# Altium project FMC_AWG_Common.PrjPCB (part 5 of 5)

## Sheet Translators_AWG.SchDoc: FMC DAC 1.5GS 4CH
size 420 x 297 mm; Author: G.Kasprowicz; CompanyName: WUT ISE; DrawnBy: G.Kasprowicz; Organization: WUT ISE; Address1: PW ISE; Address2: Nowowiejska 15/19 00-665 Warsaw; Address3: gkasprow@gmail.com; DocumentNumber: 12; Revision: 1; SheetNumber: 12; SheetTotal: 12; ModifiedBy: -; CheckedDate: -; Title2: Translators; DivGrp: WUT ISE; Designer: G.Kasprowicz; ModifiedDate: -; ProjectName: Sensor Box
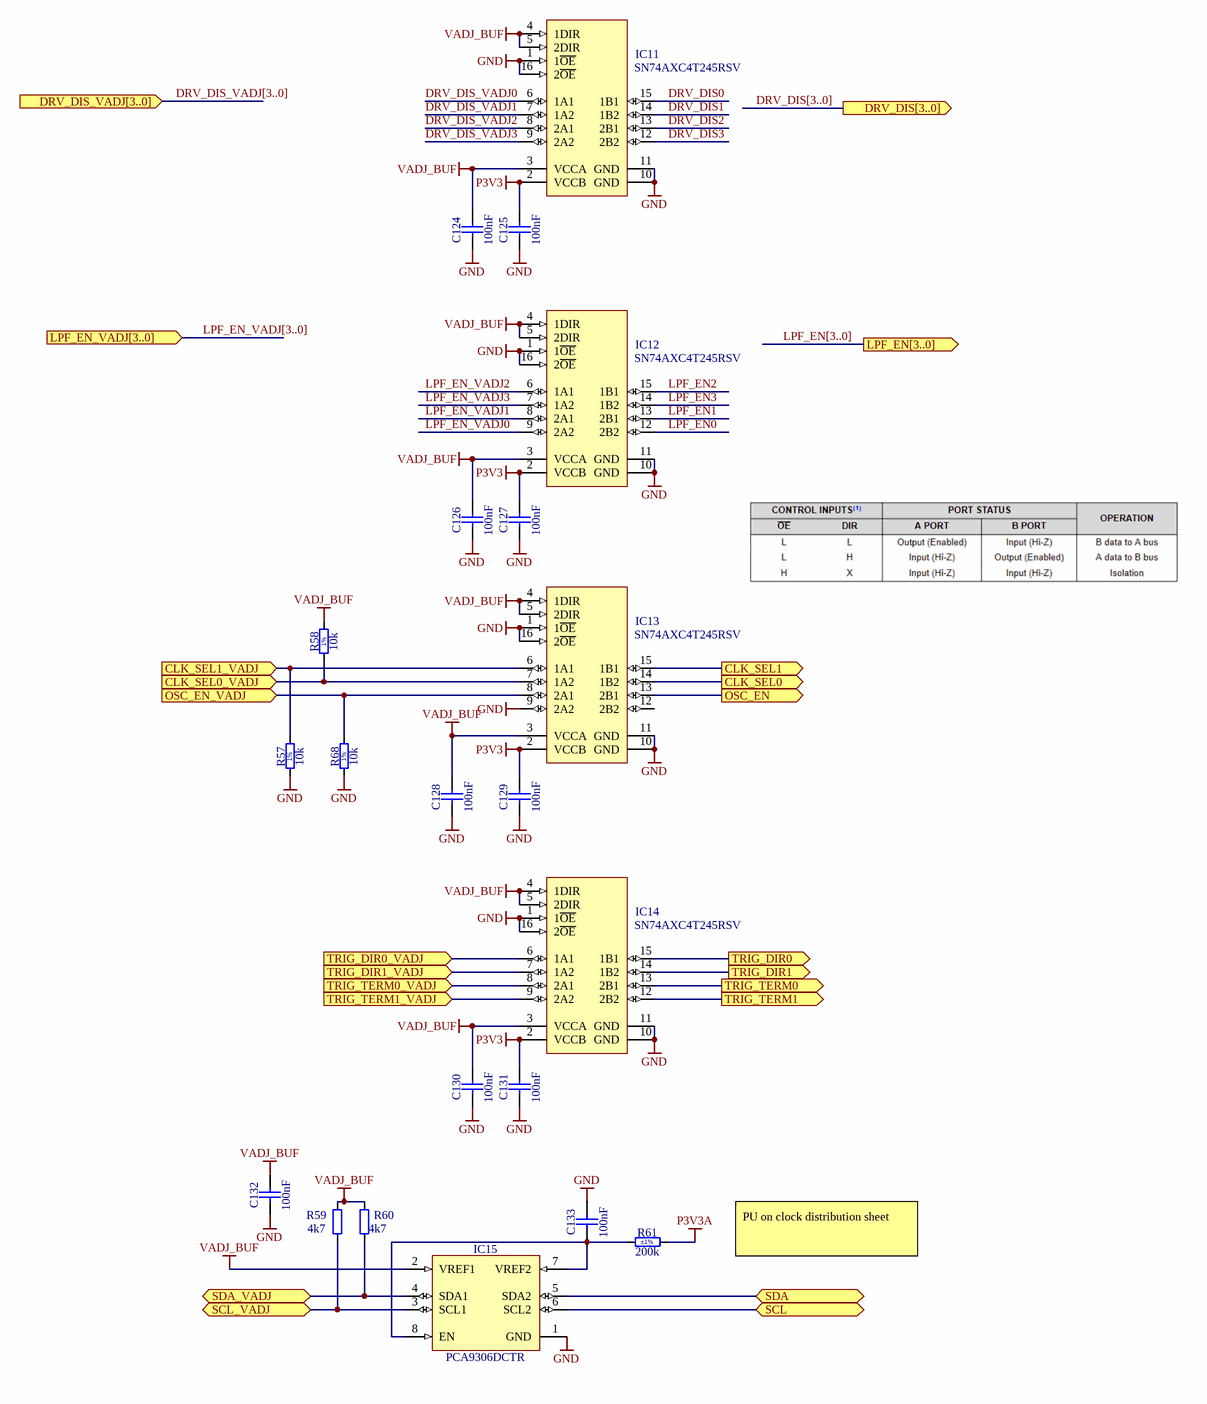
[diagram p11: Translators_AWG.SchDoc]

### Parts
C124  100nF  [CAPC1005X55N]
C125  100nF  [CAPC1005X55N]
C126  100nF  [CAPC1005X55N]
C127  100nF  [CAPC1005X55N]
C128  100nF  [CAPC1005X55N]
C129  100nF  [CAPC1005X55N]
C130  100nF  [CAPC1005X55N]
C131  100nF  [CAPC1005X55N]
C132  100nF  [CAPC1005X55N]
C133  100nF  [CAPC1005X55N]
IC11  SN74AXC4T245RSV  [QFN40P180X260X55-16N]
IC12  SN74AXC4T245RSV  [QFN40P180X260X55-16N]
IC13  SN74AXC4T245RSV  [QFN40P180X260X55-16N]
IC14  SN74AXC4T245RSV  [QFN40P180X260X55-16N]
IC15  PCA9306DCTR  [SOP65P400X130-8N]
R57  10k  [RESC1005X40N]
R58  10k  [RESC1005X40N]
R59  4k7  [RESC1005X40N]
R60  4k7  [RESC1005X40N]
R61  200k  Tolerance: ±1%  [RESC1005X40N]
R68  10k  [RESC1005X40N]

### Ports
CLK_SEL0 (out), CLK_SEL0_VADJ (in), CLK_SEL1 (out), CLK_SEL1_VADJ (in), DRV_DIS[3..0] (out), DRV_DIS_VADJ[3..0] (in), LPF_EN[3..0] (out), LPF_EN_VADJ[3..0] (in), OSC_EN (out), OSC_EN_VADJ (in), SCL (bidir), SCL_VADJ (bidir), SDA (bidir), SDA_VADJ (bidir), TRIG_DIR0 (out), TRIG_DIR0_VADJ (in), TRIG_DIR1 (out), TRIG_DIR1_VADJ (in), TRIG_TERM0 (out), TRIG_TERM0_VADJ (in), TRIG_TERM1 (out), TRIG_TERM1_VADJ (in)

### Nets
GND: C124.1 C125.1 C126.1 C127.1 C128.1 C129.1 C130.1 C131.1 C132.1 C133.2 IC11.1(1~{OE}) IC11.10(GND) IC11.11(GND) IC11.16(2~{OE}) IC12.1(1~{OE}) IC12.10(GND) IC12.11(GND) IC12.16(2~{OE}) IC13.1(1~{OE}) IC13.9(2A2) IC13.10(GND) IC13.11(GND) IC13.16(2~{OE}) IC14.1(1~{OE}) IC14.10(GND) IC14.11(GND) IC14.16(2~{OE}) IC15.1(GND) R57.1 R68.1
P3V3: C125.2 C127.2 C129.2 C131.2 IC11.2(VCCB) IC12.2(VCCB) IC13.2(VCCB) IC14.2(VCCB)
P3V3A: R61.2
VADJ_BUF: C124.2 C126.2 C128.2 C130.2 C132.2 IC11.3(VCCA) IC11.4(1DIR) IC11.5(2DIR) IC12.3(VCCA) IC12.4(1DIR) IC12.5(2DIR) IC13.3(VCCA) IC13.4(1DIR) IC13.5(2DIR) IC14.3(VCCA) IC14.4(1DIR) IC14.5(2DIR) IC15.2(VREF1) R58.2 R59.2 R60.2
CLK_SEL0: IC13.14(1B2) ; port CLK_SEL0
CLK_SEL1: IC13.15(1B1) ; port CLK_SEL1
DRV_DIS0: IC11.15(1B1)
DRV_DIS1: IC11.14(1B2)
DRV_DIS2: IC11.13(2B1)
DRV_DIS3: IC11.12(2B2)
DRV_DIS_VADJ0: IC11.6(1A1)
DRV_DIS_VADJ1: IC11.7(1A2)
DRV_DIS_VADJ2: IC11.8(2A1)
DRV_DIS_VADJ3: IC11.9(2A2)
HA01_CC_N: IC15.4(SDA1) R60.1 ; port SDA_VADJ
HA01_CC_P: IC15.3(SCL1) R59.1 ; port SCL_VADJ
HA02_N: IC14.8(2A1) ; port TRIG_TERM0_VADJ
HA02_P: IC14.9(2A2) ; port TRIG_TERM1_VADJ
HA06_P: IC14.6(1A1) ; port TRIG_DIR0_VADJ
HA07_P: IC14.7(1A2) ; port TRIG_DIR1_VADJ
HA13_N: IC13.8(2A1) R68.2 ; port OSC_EN_VADJ
HA16_N: IC13.6(1A1) R57.2 ; port CLK_SEL1_VADJ
HA16_P: IC13.7(1A2) R58.1 ; port CLK_SEL0_VADJ
LPF_EN0: IC12.12(2B2)
LPF_EN1: IC12.13(2B1)
LPF_EN2: IC12.15(1B1)
LPF_EN3: IC12.14(1B2)
LPF_EN_VADJ0: IC12.9(2A2)  [project net HA11_P]
LPF_EN_VADJ1: IC12.8(2A1)  [project net HA12_P]
LPF_EN_VADJ2: IC12.6(1A1)  [project net HA06_N]
LPF_EN_VADJ3: IC12.7(1A2)  [project net HA12_N]
NetC133_1: C133.1 IC15.7(VREF2) IC15.8(EN) R61.1
NetIC13_13: IC13.13(2B1) ; port OSC_EN
NetIC14_12: IC14.12(2B2) ; port TRIG_TERM1
NetIC14_13: IC14.13(2B1) ; port TRIG_TERM0
NetIC14_14: IC14.14(1B2) ; port TRIG_DIR1
NetIC14_15: IC14.15(1B1) ; port TRIG_DIR0
NetIC15_5: IC15.5(SDA2) ; port SDA
NetIC15_6: IC15.6(SCL2) ; port SCL

Not connected (* = marked no-connect by the designer): IC13 12(2B2)

### Buses and harness runs
bus DRV_DIS[3..0] = port DRV_DIS[3..0]
bus DRV_DIS_VADJ[3..0] = port DRV_DIS_VADJ[3..0]
bus LPF_EN[3..0] = port LPF_EN[3..0]
bus LPF_EN_VADJ[3..0] = port LPF_EN_VADJ[3..0]

### Notes on the sheet
- PU on clock distribution sheet
- Project/Equipment
- Document
- Designer
- Drawn by
- Check.by
- Copyright WUT ISE 2018.
  This documentation describes Open Hardware and is licensed under the CERN OHL v.1.1. You may redistribute and modify this documentation under the terms of the CERN OHL v.1.1. (http://ohwr.org/CERNOHL). This documentation is distributed WITHOUT ANY EXPRESS OR IMPLIED WARRANTY, INCLUDING OF MERCHANTABILITY, SATISFACTORY QUALITY AND FITNESS FOR A PARTICULAR PURPOSE. Please see the CERN OHL v.1.1 for applicable conditions.
- Contact
- File
- Last Mod.
- Print Date
- Sheet
- Size
- A3
- of
- Rev
- (in symbol R0402_10K_1%_0.0625W_100PPM) 1%

### Library data of the parts
C124-C133 = CC0402_100NF_16V_10%_X7R: Non-polarised capacitor; Part Description: SMD Multilayer Chip Ceramic Capacitor; Manufacturer: GENERIC; Manufacturer1 Part Number: GRM155R71C104KA88D; Voltage: 16V; TC: X7R; Tolerance: ±10%; Part Number: CC0402_100NF_16V_10%_X7R; Component Kind: Standard; Component Type: Standard; Pin Count: 2; Value: 100nF; Status: Not Recommended; Manufacturer Part Number: CC0402_100NF_16V_10%_X7R; Case: 0402; Mounted: Yes; Socket: No; SMD: Yes; Sense: No; Manufacturer1 Example: MURATA; Manufacturer1 ComponentHeight: 0.55mm; HelpURL: \\cern.ch\dfs\Applications\Altium\Datasheets\CC0402_X7R_MURATA_GRM.pdf; Author: CERN DEM JLC; CreateDate: 05.12.2013; LatestRevisionDate: 03.12.2007
IC11-IC14 = SN74AXC4T245: 4-Bit Dual-Supply Bus Transceiver with Configurable Voltage Translation and 3-State Output; Part Description: 4-Bit Dual-Supply Bus Transceiver With Configurable Voltage Translation and 3-State Outputs; Manufacturer: TEXAS INSTRUMENTS; PressFit: No; Bonding: No; Part Number: SN74AXC4T245RSV; Component Kind: Standard; Component Type: Standard; Device: SN74AXC4T245RSV; PackageDescription: QFN, 0.40mm Pitch, Rect.; 16 Pin, 2.60mm L X 1.80mm W X 0.55mm H Body, IPC Medium Density; Status: Recommended; Manufacturer Part Number: SN74AXC4T245RSV; Pin Count: 16; Case: QFN16; Mounted: Yes; Socket: No; SMD: Yes; Sense: No; ComponentHeight: 0.55mm; Author: GK; HelpURL: \\cern.ch\dfs\Applications\Altium\Datasheets\SN74AVC4T245RSVR.pdf; CreateDate: 08.07.2014; LatestRevisionDate: 30.03.2017
IC15 = PCA9306DCTR: Dual Bidirectional I2C Bus And SMBus Voltage-Level Translator; Manufacturer: TEXAS INSTRUMENTS; Table: Analog & Interface; Part Number: PCA9306DCTR; Component Kind: Standard; Component Type: Standard; Device: PCA9306DCTR; PackageDescription: SOP, 0.65mm, Pitch; 8 Pin, 2.80mm W X 2.95mm L X 1.30mm H Body, PC Medium Density; Part Description: Dual Bidirectional I2C Bus And SMBus Voltage-Level Translator; Manufacturer Part Number: PCA9306DCTR; Pin Count: 8; Case: SSOP8; Mounted: Yes; Socket: No; SMD: Yes; ComponentHeight: 1.3mm; Author: CERN DEM JLC; HelpURL: \\cern.ch\dfs\Applications\Altium\Datasheets\PCA9306DCTR.pdf; CreateDate: 2013-02-25; LatestRevisionDate: 2013-02-25
R57 R58 R68 = R0402_10K_1%_0.0625W_100PPM: as R51 on sheet EEPROM_Temp; Part Number: R0402_10K_1%_0.0625W_100PPM; Component Kind: Standard; Component Type: Standard; Pin Count: 2; Value: 10k; Status: Not recommended; Power: 0.0625W; Tolerance: ±1%; Manufacturer Part Number: R0402_10K_1%_0.0625W_100PPM; Case: 0402; Mounted: Yes; Socket: No; SMD: Yes; Manufacturer1 Example: YAGEO PHYCOMP; Manufacturer1 ComponentHeight: 0.4mm; HelpURL: \\cern.ch\dfs\Applications\Altium\Datasheets\R0402_Phycomp_RC0402.pdf; Author: CERN DEM JLC; CreateDate: 3/12/2007; LatestRevisionDate: 17/10/2012
R59 R60 = R0402_4k7_1%_0.0625W_100PPM: Resistor - 1%; Part Description: General Purpose Thick Film Chip Resistor; Manufacturer: GENERIC; Manufacturer1 Part Number: 232270674702L; TC: ±100ppm/°C; PressFit: No; Part Number: R0402_4K7_1%_0.0625W_100PPM; Component Kind: Standard; Component Type: Standard; Pin Count: 2; Value: 4k7; Status: Not Recommended; Power: 0.0625W; Tolerance: ±1%; Manufacturer Part Number: R0402_4K7_1%_0.0625W_100PPM; Case: 0402; Mounted: Yes; Socket: No; SMD: Yes; Manufacturer1 Example: YAGEO PHYCOMP; Manufacturer1 ComponentHeight: 0.4mm; HelpURL: \\cern.ch\dfs\Applications\Altium\Datasheets\R0402_Phycomp_RC0402.pdf; Author: CERN DEM JLC; CreateDate: 03.12.2007; LatestRevisionDate: 17.10.2012; Sense: No
R61 = R0402_200K_1%_0.0625W_100PPM: Resistor - 1%; Part Description: General Purpose Thick Film Chip Resistor; Manufacturer: GENERIC; Manufacturer1 Part Number: 232270672004L; TC: ±100ppm/°C; PressFit: No; Part Number: R0402_200K_1%_0.0625W_100PPM; Component Kind: Standard; Component Type: Standard; Pin Count: 2; Value: 200k; Status: Not Recommended; Power: 0.0625W; Manufacturer Part Number: R0402_200K_1%_0.0625W_100PPM; Case: 0402; Mounted: Yes; Sense: No; Socket: No; SMD: Yes; Manufacturer1 Example: YAGEO PHYCOMP; Manufacturer1 ComponentHeight: 0.4mm; HelpURL: \\cern.ch\dfs\Applications\Altium\Datasheets\R0402_Phycomp_RC0402.pdf; Author: CERN DEM JLC; CreateDate: 03.12.2007; LatestRevisionDate: 17.10.2012

## Sheet IO_CTRL.SchDoc: FMC DAC 1.5GS 4CH
size 420 x 297 mm; Author: G.Kasprowicz; CompanyName: WUT ISE; DrawnBy: G.Kasprowicz; Organization: WUT ISE; Address1: PW ISE; Address2: Nowowiejska 15/19 00-665 Warsaw; Address3: gkasprow@gmail.com; DocumentNumber: 8; Revision: 1; SheetNumber: 8; SheetTotal: 12; ModifiedBy: -; CheckedDate: -; Title2: IO CTRL; DivGrp: WUT ISE; Designer: G.Kasprowicz; ModifiedDate: -; ProjectName: Sensor Box
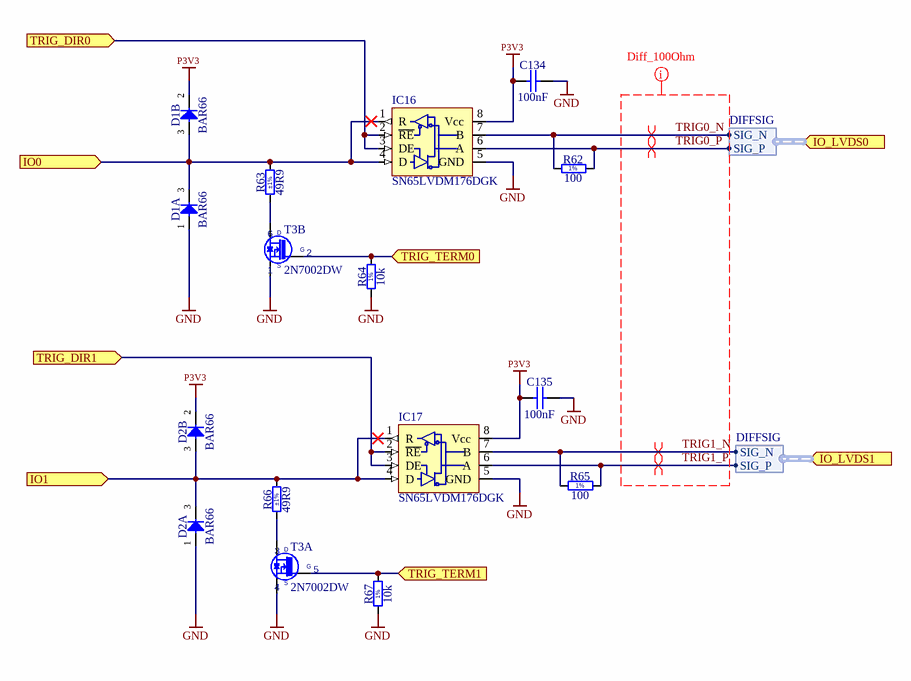
[diagram p12: IO_CTRL.SchDoc]

### Parts
C134  100nF  [CAPC1005X55N]
C135  100nF  [CAPC1005X55N]
D1  BAR66  [SOT95P240X110-3N]  (parts A,B of 2)
D2  BAR66  [SOT95P240X110-3N]  (parts A,B of 2)
IC16  SN65LVDM176DGK  [MSOP8 TI/AD]
IC17  SN65LVDM176DGK  [MSOP8 TI/AD]
R62  100  [RESC0603X28N]
R63  49R9  Tolerance: ±1%  [RESC3225X70N]
R64  10k  [RESC1005X40N]
R65  100  [RESC0603X28N]
R66  49R9  Tolerance: ±1%  [RESC3225X70N]
R67  10k  [RESC1005X40N]
T3  2N7002DW  [SOT65P210X110-6N]  (parts A,B of 2)

### Ports
IO0 (in), IO1 (in), IO_LVDS0 (in, harness DIFFSIG), IO_LVDS1 (in, harness DIFFSIG), TRIG_DIR0 (in), TRIG_DIR1 (in), TRIG_TERM0 (in), TRIG_TERM1 (in)

### Harnesses
DIFFSIG: SIG_N, SIG_P

### Nets
GND: C134.2 C135.2 D1.1(A) D2.1(A) IC16.5(GND) IC17.5(GND) R64.1 R67.1 T3.1(S2) T3.4(S1)
P3V3: C134.1 C135.1 D1.2(C) D2.2(C) IC16.8(Vcc) IC17.8(Vcc)
TRIG0_N: IC16.7(B) R62.1 ; port IO_LVDS0.SIG_N  [project net HB20_N]
TRIG0_P: IC16.6(A) R62.2 ; port IO_LVDS0.SIG_P  [project net HB20_P]
TRIG1_N: IC17.7(B) R65.1 ; port IO_LVDS1.SIG_N  [project net HB17_CC_N]
TRIG1_P: IC17.6(A) R65.2 ; port IO_LVDS1.SIG_P  [project net HB17_CC_P]
NetD1_3: D1.3(COMAC) IC16.1(R) IC16.4(D) R63.2 ; port IO0
NetD2_3: D2.3(COMAC) IC17.1(R) IC17.4(D) R66.2 ; port IO1
NetIC14_12: R67.2 T3.5(G1) ; port TRIG_TERM1
NetIC14_13: R64.2 T3.2(G2) ; port TRIG_TERM0
NetIC14_14: IC17.2(~{RE}) IC17.3(DE) ; port TRIG_DIR1
NetIC14_15: IC16.2(~{RE}) IC16.3(DE) ; port TRIG_DIR0
NetR63_1: R63.1 T3.6(D2)
NetR66_1: R66.1 T3.3(D1)

### Layout directives
differential pair: HB17_CC_N, HB17_CC_P, HB20_N, HB20_P
net class Diff_100Ohm: TRIG0_N, TRIG0_P, TRIG1_N, TRIG1_P

### Notes on the sheet
- Project/Equipment
- Document
- Designer
- Drawn by
- Check.by
- Copyright WUT ISE 2018.
  This documentation describes Open Hardware and is licensed under the CERN OHL v.1.1. You may redistribute and modify this documentation under the terms of the CERN OHL v.1.1. (http://ohwr.org/CERNOHL). This documentation is distributed WITHOUT ANY EXPRESS OR IMPLIED WARRANTY, INCLUDING OF MERCHANTABILITY, SATISFACTORY QUALITY AND FITNESS FOR A PARTICULAR PURPOSE. Please see the CERN OHL v.1.1 for applicable conditions.
- Contact
- File
- Last Mod.
- Print Date
- Sheet
- Size
- A3
- of
- Rev
- (in symbol 2N7002DW, part A) D; G; S
- (in symbol 2N7002DW, part B) D; G; S
- (in symbol R0201_100R_1%_0.05W_200PPM) 1%
- (in symbol R0402_10K_1%_0.0625W_100PPM) 1%

### Library data of the parts
C134 C135 = CC0402_100NF_16V_10%_X5R: Non-polarised capacitor; Part Description: SMD Multilayer Chip Ceramic Capacitor; Manufacturer: GENERIC; Manufacturer1 Part Number: GRM155R61C104KA88D; Voltage: 16V; TC: X5R; Tolerance: ±10%; Part Number: CC0402_100NF_16V_10%_X5R; Component Kind: Standard; Component Type: Standard; Pin Count: 2; Value: 100nF; Status: None; Manufacturer Part Number: CC0402_100NF_16V_10%_X5R; Case: 0402; Mounted: Yes; Socket: No; SMD: Yes; Sense: No; Manufacturer1 Example: MURATA; Manufacturer1 ComponentHeight: 0.55mm; HelpURL: \\cern.ch\dfs\Applications\Altium\Datasheets\CC0402_X5R_MURATA_GRM.pdf; Author: CERN DEM JLC; CreateDate: 10.12.2013; LatestRevisionDate: 10.12.2013
D1 D2 = BAR66: Serial Diode; Part Description: Silicon PIN Diode Array (Series Connected); Manufacturer: INFINEON; Voltage: 150V; Power: 250mA; Table: Diodes; Part Number: BAR66; Component Kind: Standard; Component Type: Standard; Device: BAR66; PackageDescription: SOT23 3-Leads, Pitch 0.95mm - Body 1.3x2.9mm, IPC Medium Density; Manufacturer Part Number: BAR66; Pin Count: 3; Case: SOT23; Mounted: Yes; Socket: No; SMD: Yes; ComponentHeight: 1.1mm; HelpURL: \\cern.ch\dfs\Applications\Altium\Datasheets\BAR66.pdf; Author: CERN DEM JLC; CreateDate: 18/1/2010; LatestRevisionDate: 5/10/2010
IC16 IC17 = SN65LVDM176: High Speed Differential Transceiver LVDS/LVTTL; ComponentLink1Description: Datasheet; ComponentLink1URL: C:\TSR\Laurin\Projects\FMC\CERN DAC\Parts\Digital\SN65LVDM176.pdf
R62 R65 = R0201_100R_1%_0.05W_200PPM: Resistor - 1%; Part Description: Thick Film Chip Resistor; Manufacturer: GENERIC; Manufacturer1 Part Number: CRCW0201100RFNED; Power: 0.05W; TC: ±200ppm/°C; PressFit: No; Part Number: R0201_100R_1%_0.05W_200PPM; Component Kind: Standard; Component Type: Standard; Pin Count: 2; Value: 100; Status: Not Recommended; Tolerance: ±1%; Manufacturer Part Number: R0201_100R_1%_0.05W_200PPM; Case: 0201; Mounted: Yes; Socket: No; SMD: Yes; Manufacturer1 Example: VISHAY; Manufacturer1 ComponentHeight: 0.27mm; HelpURL: \\cern.ch\dfs\Applications\Altium\Datasheets\R0201_VISHAY_CRCW0201 e3.pdf; Author: CERN DEM JLC; CreateDate: 13.11.2014; LatestRevisionDate: 13.11.2014; Sense: No
R63 R66 = R1210_49R9_1%_0.5W_100PPM_VISHAY_CRCW: Resistor - 1%; Part Description: Thick Film Chip Resistor; Manufacturer: VISHAY DRALORIC; Manufacturer Part Number: CRCW121049R9FK; Power: 0.5W; TC: ±100ppm/°C; PressFit: No; Part Number: R1210_49R9_1%_0.5W_100PPM_VISHAY_CRCW; Component Kind: Standard; Component Type: Standard; Pin Count: 2; Value: 49R9; Status: None; Case: 1210; Mounted: Yes; Sense: No; Socket: No; SMD: Yes; ComponentHeight: 0.7mm; HelpURL: \\cern.ch\dfs\Applications\Altium\Datasheets\R1210_VISHAY_CRCW1210.pdf; Author: CERN DEM JMW; CreateDate: 06.08.2014; LatestRevisionDate: 06.08.2014
R64 R67 = R0402_10K_1%_0.0625W_100PPM: Resistor - 1%; Part Description: General Purpose Thick Film Chip Resistor; Manufacturer: GENERIC; Manufacturer1 Part Number: 232270671003L; TC: ±100ppm/°C; Table: Resistors SMD; Part Number: R0402_10K_1%_0.0625W_100PPM; Component Kind: Standard; Component Type: Standard; Pin Count: 2; Value: 10k; Status: Not recommended; Power: 0.0625W; Tolerance: ±1%; Manufacturer Part Number: R0402_10K_1%_0.0625W_100PPM; Case: 0402; Mounted: Yes; Socket: No; SMD: Yes; Manufacturer1 Example: YAGEO PHYCOMP; Manufacturer1 ComponentHeight: 0.4mm; HelpURL: \\cern.ch\dfs\Applications\Altium\Datasheets\R0402_Phycomp_RC0402.pdf; Author: CERN DEM JLC; CreateDate: 3/12/2007; LatestRevisionDate: 17/10/2012
T3 = 2N7002DW: 60 V, 115 mA, Dual N-Channel Field Effect Transistor, Enhancement Mode; Part Description: 60V 115mA Dual N-Channel Field Effect Transistor, Enhancement Mode; Manufacturer: ON SEMICONDUCTOR; PressFit: No; Bonding: No; Part Number: 2N7002DW; Component Kind: Standard; Component Type: Standard; Device: 2N7002DW; PackageDescription: SOT363, SC70-6, 0.65mm Pitch; 6 Pin, 1.25mm W X 2.00mm L X 1.10mm H body, IPC Medium Density; Manufacturer Part Number: 2N7002DW; Pin Count: 6; Case: SOT363; Mounted: Yes; Socket: No; SMD: Yes; Sense: No; ComponentHeight: 1.1mm; HelpURL: \\cern.ch\dfs\Applications\Altium\Datasheets\2N7002DW.pdf; Author: CERN DEM BC; CreateDate: 25.11.2020; LatestRevisionDate: 25.11.2020

## Nets that join several sheets
3P3VAUX: DAC_FMC_connector (J2.d32), EEPROM_Temp (11 pins)
GND: FMC_AWG_DAC_PSU (51 pins), FMC_AWG_DAC_PSU_LDO (29 pins), FMC_DAC_1_5GS_4CH (12 pins), AWG_PWR_Supply (47 pins), CLK_INPUT (21 pins), DAC (21 pins), DAC_SUPPLY (114 pins), DAC_FMC_connector (164 pins), U_FMC_DAC_1_5GS_4CH/U_Driver_Filter0 (20 pins), U_FMC_DAC_1_5GS_4CH/U_Driver_Filter1 (20 pins), U_FMC_DAC_1_5GS_4CH/U_Driver_Filter2 (20 pins), U_FMC_DAC_1_5GS_4CH/U_Driver_Filter3 (20 pins), EEPROM_Temp (14 pins), Translators_AWG (30 pins), IO_CTRL (10 pins)
N7V5A: FMC_AWG_DAC_PSU (J200.7 J200.8), FMC_AWG_DAC_PSU_LDO (8 pins), AWG_PWR_Supply (J1.7 J1.8), U_FMC_DAC_1_5GS_4CH/U_Driver_Filter0 (C120A.2 L15A.2), U_FMC_DAC_1_5GS_4CH/U_Driver_Filter1 (C120B.2 L15B.2), U_FMC_DAC_1_5GS_4CH/U_Driver_Filter2 (C120C.2 L15C.2), U_FMC_DAC_1_5GS_4CH/U_Driver_Filter3 (C120D.2 L15D.2)
N8V0: FMC_AWG_DAC_PSU (10 pins), FMC_AWG_DAC_PSU_LDO (L206.1)
P1V2A: AWG_PWR_Supply (5 pins), DAC_SUPPLY (24 pins)
P1V2D: AWG_PWR_Supply (5 pins), DAC_SUPPLY (22 pins)
P1V7: FMC_AWG_DAC_PSU (5 pins), FMC_AWG_DAC_PSU_LDO (T200.5 TP211.1), AWG_PWR_Supply (J1.17 J1.18 L9.1)
P3V3: FMC_AWG_DAC_PSU (8 pins), FMC_AWG_DAC_PSU_LDO (R220.2 TP206.1), AWG_PWR_Supply (6 pins), CLK_INPUT (LD1.2 LD1.4), DAC (R24.2), DAC_FMC_connector (5 pins), Translators_AWG (8 pins), IO_CTRL (6 pins)
P3V3A: AWG_PWR_Supply (6 pins), CLK_INPUT (L1#2.1 L2.2), DAC (L3.1), DAC_SUPPLY (L4.2 L6.2 L8.2), Translators_AWG (R61.2)
P3V6: FMC_AWG_DAC_PSU (8 pins), FMC_AWG_DAC_PSU_LDO (R218.2 TP205.1), AWG_PWR_Supply (J1.13 J1.14 L11.1)
P7V5A: FMC_AWG_DAC_PSU (J200.29 J200.30), FMC_AWG_DAC_PSU_LDO (7 pins), AWG_PWR_Supply (J1.29 J1.30), U_FMC_DAC_1_5GS_4CH/U_Driver_Filter0 (C114A.2 L13A.2), U_FMC_DAC_1_5GS_4CH/U_Driver_Filter1 (C114B.2 L13B.2), U_FMC_DAC_1_5GS_4CH/U_Driver_Filter2 (C114C.2 L13C.2), U_FMC_DAC_1_5GS_4CH/U_Driver_Filter3 (C114D.2 L13D.2)
P8V0: FMC_AWG_DAC_PSU (6 pins), FMC_AWG_DAC_PSU_LDO (L204.1)
P12V0: FMC_AWG_DAC_PSU (15 pins), FMC_AWG_DAC_PSU_LDO (R221.2 R226.2 TP208.1), AWG_PWR_Supply (J1.3 J1.4), DAC_FMC_connector (J2.c35 J2.c37)
VADJ: FMC_DAC_1_5GS_4CH (R41.2), AWG_PWR_Supply (L10.1), DAC_SUPPLY (L7.2), DAC_FMC_connector (J2.e39 J2.f40 J2.g39 J2.h40)
VADJ_BUF: AWG_PWR_Supply (C103.1 L10.2 R30.2), Translators_AWG (21 pins)
CLK2_BIDIR_N: CLK_INPUT (C13#2.1), DAC_FMC_connector (J2.k5)
CLK2_BIDIR_P: CLK_INPUT (C11#2.1), DAC_FMC_connector (J2.k4)
CLK3_BIDIR_N: CLK_INPUT (C15.1), DAC_FMC_connector (J2.j3)
CLK3_BIDIR_P: CLK_INPUT (C14.1), DAC_FMC_connector (J2.j2)
CLK_SEL0: CLK_INPUT (IC1.15 T1.5), Translators_AWG (IC13.14)
CLK_SEL1: CLK_INPUT (IC1.18 T1.2), Translators_AWG (IC13.15)
DAC_ALARM: DAC (U1.N12), DAC_FMC_connector (J2.k35)
DAC_CLK_N: CLK_INPUT (C12#2.2), DAC (R20.2 U1.A11)
DAC_CLK_P: CLK_INPUT (C10#2.2), DAC (R20.1 U1.A12)
DAC_RESETB: DAC (R23.1 U1.N10), DAC_FMC_connector (J2.e36)
DAC_SCLK: DAC (B2.1 U1.P9), DAC_FMC_connector (J2.f31)
DAC_SDENB: DAC (B5.1 U1.P10), DAC_FMC_connector (J2.e33)
DAC_SDIO: DAC (B3.1 U1.P11), DAC_FMC_connector (J2.e34)
DAC_SDO: DAC (B4.1 U1.P12), DAC_FMC_connector (J2.j36)
DAC_SLEEP: DAC (R24.1 U1.N11), DAC_FMC_connector (J2.e37)
DAC_TXENA: DAC (B6.1 U1.N9), DAC_FMC_connector (J2.e31)
DATA_CLK_N: DAC (U1.G1), DAC_FMC_connector (J2.h23)
DATA_CLK_P: DAC (U1.G2), DAC_FMC_connector (J2.h22)
DRV_DIS0: U_FMC_DAC_1_5GS_4CH/U_Driver_Filter0 (IC7A.10), Translators_AWG (IC11.15)
DRV_DIS1: U_FMC_DAC_1_5GS_4CH/U_Driver_Filter1 (IC7B.10), Translators_AWG (IC11.14)
DRV_DIS2: U_FMC_DAC_1_5GS_4CH/U_Driver_Filter2 (IC7C.10), Translators_AWG (IC11.13)
DRV_DIS3: U_FMC_DAC_1_5GS_4CH/U_Driver_Filter3 (IC7D.10), Translators_AWG (IC11.12)
DRV_DIS_VADJ0: DAC_FMC_connector (J2.j7), Translators_AWG (IC11.6)
DRV_DIS_VADJ1: DAC_FMC_connector (J2.f8), Translators_AWG (IC11.7)
DRV_DIS_VADJ2: DAC_FMC_connector (J2.f7), Translators_AWG (IC11.8)
DRV_DIS_VADJ3: DAC_FMC_connector (J2.j6), Translators_AWG (IC11.9)
GA0: DAC_FMC_connector (J2.c34), EEPROM_Temp (IC10.2)
GA1: DAC_FMC_connector (J2.d35), EEPROM_Temp (IC10.1)
HA00_CC_N: CLK_INPUT (C9.2), DAC_FMC_connector (J2.f5)
HA00_CC_P: CLK_INPUT (C8#2.2), DAC_FMC_connector (J2.f4)
HA01_CC_N: DAC_FMC_connector (J2.e3), Translators_AWG (IC15.4 R60.1)
HA01_CC_P: DAC_FMC_connector (J2.e2), Translators_AWG (IC15.3 R59.1)
HA02_N: DAC_FMC_connector (J2.k8), Translators_AWG (IC14.8)
HA02_P: DAC_FMC_connector (J2.k7), Translators_AWG (IC14.9)
HA05_P: AWG_PWR_Supply (6 pins), DAC_FMC_connector (J2.e6), EEPROM_Temp (IC8.3 IC9.3)
HA06_N: DAC_FMC_connector (J2.k11), Translators_AWG (IC12.6)
HA06_P: DAC_FMC_connector (J2.k10), Translators_AWG (IC14.6)
HA07_P: DAC_FMC_connector (J2.j9), Translators_AWG (IC14.7)
HA10_N: DAC (C33.1), DAC_FMC_connector (J2.k14)
HA10_P: DAC (C31.1), DAC_FMC_connector (J2.k13)
HA11_P: DAC_FMC_connector (J2.j12), Translators_AWG (IC12.9)
HA12_N: DAC_FMC_connector (J2.f14), Translators_AWG (IC12.7)
HA12_P: DAC_FMC_connector (J2.f13), Translators_AWG (IC12.8)
HA13_N: DAC_FMC_connector (J2.e13), Translators_AWG (IC13.8 R68.2)
HA16_N: DAC_FMC_connector (J2.e16), Translators_AWG (IC13.6 R57.2)
HA16_P: DAC_FMC_connector (J2.e15), Translators_AWG (IC13.7 R58.1)
HA22_N: DAC (U1.P8), DAC_FMC_connector (J2.j22)
HA22_P: DAC (U1.N8), DAC_FMC_connector (J2.j21)
HB00_CC_N: DAC (U1.H1), DAC_FMC_connector (J2.k26)
HB00_CC_P: DAC (U1.H2), DAC_FMC_connector (J2.k25)
HB08_N: FMC_DAC_1_5GS_4CH (R43.1), DAC_FMC_connector (J2.f29)
HB08_P: FMC_DAC_1_5GS_4CH (R42.1), DAC_FMC_connector (J2.f28)
HB09_N: FMC_DAC_1_5GS_4CH (R41.1), DAC_FMC_connector (J2.e28)
HB13_P: FMC_DAC_1_5GS_4CH (R44.1), DAC_FMC_connector (J2.e30)
HB17_CC_N: DAC_FMC_connector (J2.k38), IO_CTRL (IC17.7 R65.1)
HB17_CC_P: DAC_FMC_connector (J2.k37), IO_CTRL (IC17.6 R65.2)
HB20_N: DAC_FMC_connector (J2.f38), IO_CTRL (IC16.7 R62.1)
HB20_P: DAC_FMC_connector (J2.f37), IO_CTRL (IC16.6 R62.2)
IOUTA_N: DAC (R13.1 U1.C14), U_FMC_DAC_1_5GS_4CH/U_Driver_Filter0 (IC7A.3 R48A.2)
IOUTA_P: DAC (R12.1 U1.B14), U_FMC_DAC_1_5GS_4CH/U_Driver_Filter0 (IC7A.2 R46A.1)
IOUTB_N: DAC (R15.1 U1.E14), U_FMC_DAC_1_5GS_4CH/U_Driver_Filter1 (IC7B.3 R48B.2)
IOUTB_P: DAC (R14.1 U1.F14), U_FMC_DAC_1_5GS_4CH/U_Driver_Filter1 (IC7B.2 R46B.1)
IOUTC_N: DAC (R17.1 U1.K14), U_FMC_DAC_1_5GS_4CH/U_Driver_Filter2 (IC7C.3 R48C.2)
IOUTC_P: DAC (R16.1 U1.J14), U_FMC_DAC_1_5GS_4CH/U_Driver_Filter2 (IC7C.2 R46C.1)
IOUTD_N: DAC (R19.1 U1.M14), U_FMC_DAC_1_5GS_4CH/U_Driver_Filter3 (IC7D.3 R48D.2)
IOUTD_P: DAC (R18.1 U1.N14), U_FMC_DAC_1_5GS_4CH/U_Driver_Filter3 (IC7D.2 R46D.1)
LA00_CC_N: DAC (U1.B8), DAC_FMC_connector (J2.g7)
LA00_CC_P: DAC (U1.A8), DAC_FMC_connector (J2.g6)
LA01_CC_N: DAC (U1.B7), DAC_FMC_connector (J2.d9)
LA01_CC_P: DAC (U1.A7), DAC_FMC_connector (J2.d8)
LA02_N: DAC (U1.B4), DAC_FMC_connector (J2.h8)
LA02_P: DAC (U1.A4), DAC_FMC_connector (J2.h7)
LA03_N: DAC (U1.B3), DAC_FMC_connector (J2.g10)
LA03_P: DAC (U1.A3), DAC_FMC_connector (J2.g9)
LA04_N: DAC (U1.B2), DAC_FMC_connector (J2.h11)
LA04_P: DAC (U1.A2), DAC_FMC_connector (J2.h10)
LA05_N: DAC (U1.B5), DAC_FMC_connector (J2.d12)
LA05_P: DAC (U1.A5), DAC_FMC_connector (J2.d11)
LA06_N: DAC (U1.B6), DAC_FMC_connector (J2.c11)
LA06_P: DAC (U1.A6), DAC_FMC_connector (J2.c10)
LA07_N: DAC (U1.C1), DAC_FMC_connector (J2.h14)
LA07_P: DAC (U1.C2), DAC_FMC_connector (J2.h13)
LA08_N: DAC (U1.B1), DAC_FMC_connector (J2.g13)
LA08_P: DAC (U1.A1), DAC_FMC_connector (J2.g12)
LA09_N: DAC (U1.D3), DAC_FMC_connector (J2.d15)
LA09_P: DAC (U1.D4), DAC_FMC_connector (J2.d14)
LA10_N: DAC (U1.C3), DAC_FMC_connector (J2.c15)
LA10_P: DAC (U1.C4), DAC_FMC_connector (J2.c14)
LA11_N: DAC (U1.E1), DAC_FMC_connector (J2.h17)
LA11_P: DAC (U1.E2), DAC_FMC_connector (J2.h16)
LA12_N: DAC (U1.D1), DAC_FMC_connector (J2.g16)
LA12_P: DAC (U1.D2), DAC_FMC_connector (J2.g15)
LA13_N: DAC (U1.E3), DAC_FMC_connector (J2.d18)
LA13_P: DAC (U1.E4), DAC_FMC_connector (J2.d17)
LA14_N: DAC (U1.G3), DAC_FMC_connector (J2.c19)
LA14_P: DAC (U1.G4), DAC_FMC_connector (J2.c18)
LA15_N: DAC (U1.F1), DAC_FMC_connector (J2.h20)
LA15_P: DAC (U1.F2), DAC_FMC_connector (J2.h19)
LA16_N: DAC (U1.F3), DAC_FMC_connector (J2.g19)
LA16_P: DAC (U1.F4), DAC_FMC_connector (J2.g18)
LA17_CC_N: DAC (U1.H3), DAC_FMC_connector (J2.d21)
LA17_CC_P: DAC (U1.H4), DAC_FMC_connector (J2.d20)
LA18_CC_N: DAC (U1.K3), DAC_FMC_connector (J2.c23)
LA18_CC_P: DAC (U1.K4), DAC_FMC_connector (J2.c22)
LA20_N: DAC (U1.J3), DAC_FMC_connector (J2.g22)
LA20_P: DAC (U1.J4), DAC_FMC_connector (J2.g21)
LA21_N: DAC (U1.P1), DAC_FMC_connector (J2.h26)
LA21_P: DAC (U1.N1), DAC_FMC_connector (J2.h25)
LA22_N: DAC (U1.M3), DAC_FMC_connector (J2.g25)
LA22_P: DAC (U1.M4), DAC_FMC_connector (J2.g24)
LA23_N: DAC (U1.L3), DAC_FMC_connector (J2.d24)
LA23_P: DAC (U1.L4), DAC_FMC_connector (J2.d23)
LA24_N: DAC (U1.J1), DAC_FMC_connector (J2.h29)
LA24_P: DAC (U1.J2), DAC_FMC_connector (J2.h28)
LA25_N: DAC (U1.P4), DAC_FMC_connector (J2.g28)
LA25_P: DAC (U1.N4), DAC_FMC_connector (J2.g27)
LA26_N: DAC (U1.P3), DAC_FMC_connector (J2.d27)
LA26_P: DAC (U1.N3), DAC_FMC_connector (J2.d26)
LA27_N: DAC (U1.P2), DAC_FMC_connector (J2.c27)
LA27_P: DAC (U1.N2), DAC_FMC_connector (J2.c26)
LA28_N: DAC (U1.K1), DAC_FMC_connector (J2.h32)
LA28_P: DAC (U1.K2), DAC_FMC_connector (J2.h31)
LA29_N: DAC (U1.P5), DAC_FMC_connector (J2.g31)
LA29_P: DAC (U1.N5), DAC_FMC_connector (J2.g30)
LA30_N: DAC (U1.L1), DAC_FMC_connector (J2.h35)
LA30_P: DAC (U1.L2), DAC_FMC_connector (J2.h34)
LA31_N: DAC (U1.P6), DAC_FMC_connector (J2.g34)
LA31_P: DAC (U1.N6), DAC_FMC_connector (J2.g33)
LA32_N: DAC (U1.P7), DAC_FMC_connector (J2.h38)
LA32_P: DAC (U1.N7), DAC_FMC_connector (J2.h37)
LA33_N: DAC (U1.M1), DAC_FMC_connector (J2.g37)
LA33_P: DAC (U1.M2), DAC_FMC_connector (J2.g36)
LPF_EN0: U_FMC_DAC_1_5GS_4CH/U_Driver_Filter0 (IC7A.4), Translators_AWG (IC12.12)
LPF_EN1: U_FMC_DAC_1_5GS_4CH/U_Driver_Filter1 (IC7B.4), Translators_AWG (IC12.13)
LPF_EN2: U_FMC_DAC_1_5GS_4CH/U_Driver_Filter2 (IC7C.4), Translators_AWG (IC12.15)
LPF_EN3: U_FMC_DAC_1_5GS_4CH/U_Driver_Filter3 (IC7D.4), Translators_AWG (IC12.14)
NetC6#2_2: FMC_DAC_1_5GS_4CH (J5.1), CLK_INPUT (C6#2.2)
NetD1_3: FMC_DAC_1_5GS_4CH (J8.1), IO_CTRL (D1.3 IC16.1 IC16.4 R63.2)
NetD2_3: FMC_DAC_1_5GS_4CH (J9.1), IO_CTRL (D2.3 IC17.1 IC17.4 R66.2)
NetIC13_13: CLK_INPUT (R8#2.1), Translators_AWG (IC13.13)
NetIC14_12: Translators_AWG (IC14.12), IO_CTRL (R67.2 T3.5)
NetIC14_13: Translators_AWG (IC14.13), IO_CTRL (R64.2 T3.2)
NetIC14_14: Translators_AWG (IC14.14), IO_CTRL (IC17.2 IC17.3)
NetIC14_15: Translators_AWG (IC14.15), IO_CTRL (IC16.2 IC16.3)
NetIC15_5: CLK_INPUT (OSC1.7 R1.1 TP1.1), Translators_AWG (IC15.5)
NetIC15_6: CLK_INPUT (OSC1.8 R2.1 TP2.1), Translators_AWG (IC15.6)
NetJ3_1: FMC_DAC_1_5GS_4CH (J3.1), U_FMC_DAC_1_5GS_4CH/U_Driver_Filter0 (R47A.2)
NetJ4_1: FMC_DAC_1_5GS_4CH (J4.1), U_FMC_DAC_1_5GS_4CH/U_Driver_Filter1 (R47B.2)
NetJ6_1: FMC_DAC_1_5GS_4CH (J6.1), U_FMC_DAC_1_5GS_4CH/U_Driver_Filter2 (R47C.2)
NetJ7_1: FMC_DAC_1_5GS_4CH (J7.1), U_FMC_DAC_1_5GS_4CH/U_Driver_Filter3 (R47D.2)
PG_M2C: AWG_PWR_Supply (6 pins), DAC_FMC_connector (J2.f1)
SCL: DAC_FMC_connector (J2.c30), EEPROM_Temp (B12.1 IC10.6 R54.2 R56.1)
SDA: DAC_FMC_connector (J2.c31), EEPROM_Temp (B11.1 IC10.5 R53.2 R55.1)
SG0: FMC_DAC_1_5GS_4CH (C109.1 J5.2 R39.2 R40.2), CLK_INPUT (TR1.4)

## Assembly variants
Standard: not fitted IC2 R5 R211